# EAGLE design ActiveHeadphoneBreadboard (EAGLE 6.0)
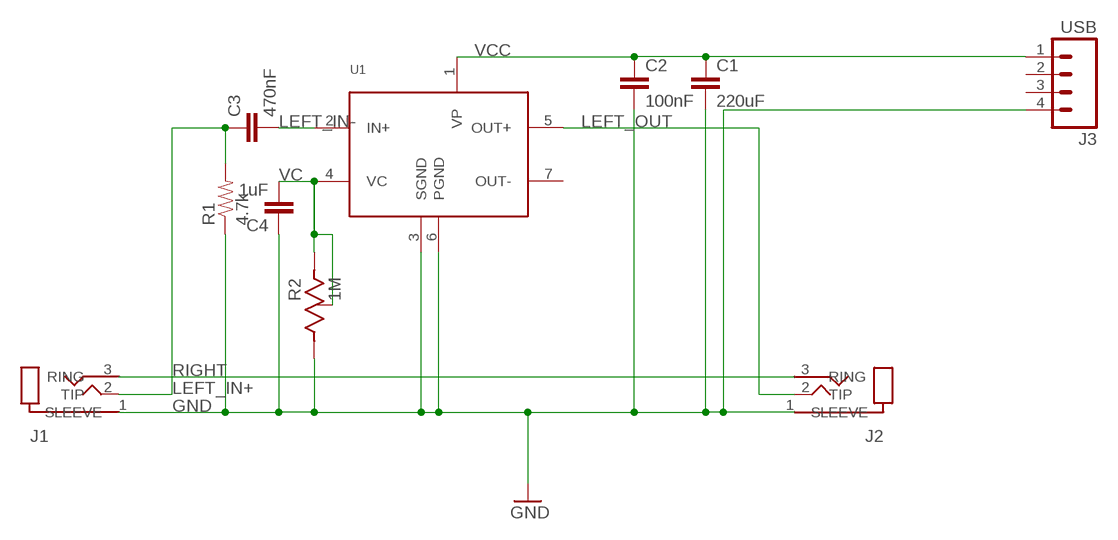
[diagram p0: schematic, sheet 1]

## Parts
C1  220uF  CAPPTH1  [CAP-PTH-5MM]
C2  100nF  CAPPTH1  [CAP-PTH-5MM]
C3  470nF  CAPPTH  [CAP-PTH-SMALL]
C4  1uF  CAPPTH  [CAP-PTH-SMALL]
J1  SJ1-35XXPTH  [SJ1-3523N]
J2  SJ1-35XXPTH  [SJ1-3523N]
J3  USB  M04PTH  [1X04]
R1  4.7k  RESISTORPTH-1/4W  [AXIAL-0.4]
R2  1M  3352T  [3352T]
U1  TDA7052  [DIL-8]

## Nets
GND: C1.2 C2.2 C4.1 J1.1(SLEEVE) J2.1(SLEEVE) J3.4 R1.P$1 R2.1(CCW) U1.3(SGND) U1.6(PGND)
LEFT_IN+: C3.1 J1.2(TIP) R1.P$2
LEFT_IN-: C3.2 U1.2(IN+)
LEFT_OUT: J2.2(TIP) U1.5(OUT+)
RIGHT: J1.3(RING) J2.3(RING)
VC: C4.2 R2.2(WIPER) R2.3(CW) U1.4(VC)
VCC: C1.1 C2.1 J3.1 U1.1(VP)
Unconnected: J3.2 J3.3 U1.7(OUT-)

## Library data of the parts
C1-C4 = SparkFun:CAP: Capacitor Standard 0603 ceramic capacitor, and 0.1" leaded capacitor.
J1 J2 = KwanSystems:SJ1-35XX
J3 = SparkFun:M04: Header 4 Standard 4-pin 0.1" header. Use with straight break away headers (SKU : PRT-00116), right angle break away headers (PRT-00553), swiss pins (PRT-00743), machine pins (PRT-00117), and female headers (PRT-00115). Molex polarized connector foot print use with SKU : PRT-08231 with associated crimp pins and housings. 1MM SMD Version SKU: PRT-10208
R1 = SparkFun:RESISTOR: Resistor Basic schematic elements and footprints for 0603, 1206, and PTH resistors.
R2 = KwanSystems:3352T
U1 = KwanSystems:TDA7052

## Net classes
0 default: width 0.33 mm, drill 0.33 mm, clearance 0.33 mm

## Board
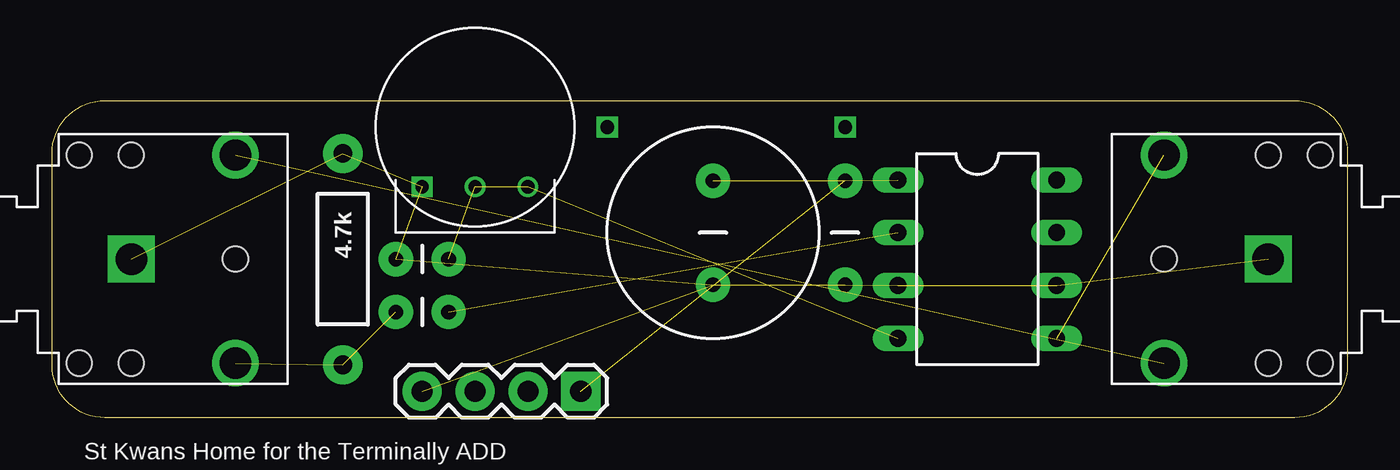
[diagram p1: board, top side]
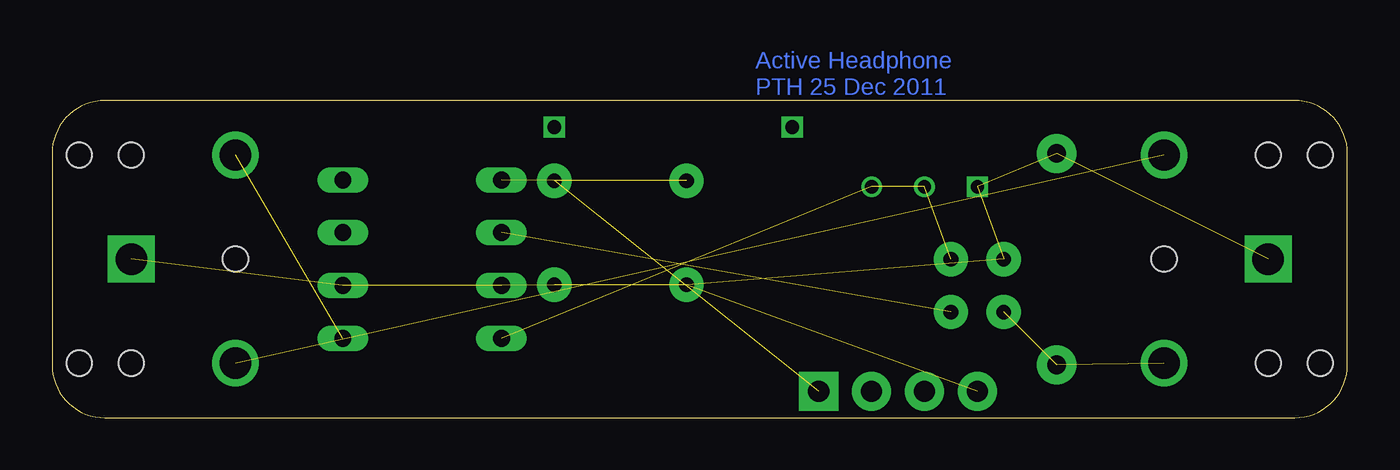
[diagram p2: board, bottom side, seen from below]

Size 62.23 x 15.24 mm. Coordinates in mm from the lower left corner, seen from the top.
Outline: 0,2.54 0,12.7 arc-90 2.54,15.24 59.69,15.24 arc-90 62.23,12.7 62.23,2.54 arc-90 59.69,0 2.54,0 arc-90 0,2.54
Copper layers (1*16): Top 0.0356mm / dielectric 1.5011mm / Bottom 0.0356mm
Design rules: minimum track width 6mil, minimum drill 13mil, track to track 6mil, track to pad 6mil, pad to pad 6mil, via to via 6mil, smd to smd 6mil, copper to edge 15mil, drill to drill 6mil, minimum pad ring 7mil, minimum via ring 7mil, stop-mask expansion 4mil, vias tented up to drill 0mil, thermal gap 10mil

### Footprints (pad centres in the part's own frame; a part is rotated, then mirrored left to right if it is on the bottom)
CAP-PTH-5MM = drill 0.7 pad 1.651: 1 -2.5,0; 2 2.5,0
CAP-PTH-SMALL = drill 0.7 pad 1.651: 1 0,0; 2 2.54,0
SJ1-3523N = drill 1.5 square: 1 0,0 | drill 1.5: 2 5,-5; 3 5,5 | hole 1.2: 0,-5; -2.5,-5; -2.5,5; 0,5; 5,0
1X04 = drill 1.016 pad 1.88 square: 1 0,0 | drill 1.016 pad 1.88: 2 2.54,0; 3 5.08,0; 4 7.62,0
AXIAL-0.4 = drill 0.9 pad 1.88: P$1 -5.08,0; P$2 5.08,0
3352T = drill 0.635 square: 1 -2.54,-2.87 | drill 0.635: 2 0,-2.87; 3 2.54,-2.87
DIL-8 = drill 0.813 long: 1 -3.81,-3.81; 2 -1.27,-3.81; 3 1.27,-3.81; 4 3.81,-3.81; 5 3.81,3.81; 6 1.27,3.81; 7 -1.27,3.81; 8 -3.81,3.81

### Placement (x,y rotation side)
C1  31.75,8.89 270 top
C2  38.1,8.89 270 top
C3  16.51,5.08 0 top
C4  16.51,7.62 0 top
J1  3.81,7.62 0 top
J2  58.42,7.62 180 top
J3  25.4,1.27 180 top
R1  13.97,7.62 270 top
R2  20.32,13.97 0 top
U1  44.45,7.62 270 top

### Tracks (layer width: path | path; a pad name or v marks a point on that pad's centre or on a via)
GND  (9 unrouted)
LEFT_IN+  (2 unrouted)
LEFT_IN-  (1 unrouted)
LEFT_OUT  (1 unrouted)
N$3  (via drill 0.66)
  other vias: 26.67,13.97
N$8  (via drill 0.66)
  other vias: 38.1,13.97
RIGHT  (1 unrouted)
VC  (3 unrouted)
VCC  (3 unrouted)

### Text on the board
Bottom: Active Headphone | PTH 25 Dec 2011
tPlace: St Kwans Home for the Terminally ADD